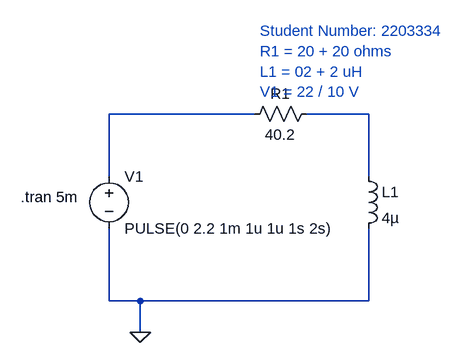
[diagram p0: schematic Lab3 - Step Response of RL Circuit.asc]
Lab3 - Step Response of RL Circuit.asc, the LTspice schematic file:
Version 4
SHEET 1 880 680
WIRE -176 -240 -400 -240
WIRE 0 -240 -96 -240
WIRE -400 -144 -400 -240
WIRE 0 -144 0 -240
WIRE -400 48 -400 -64
WIRE -352 48 -400 48
WIRE 0 48 0 -64
WIRE 0 48 -352 48
WIRE -352 96 -352 48
FLAG -352 96 0
SYMBOL res -80 -256 R90
WINDOW 0 0 56 VBottom 2
WINDOW 3 32 56 VTop 2
SYMATTR InstName R1
SYMATTR Value 40.2
SYMBOL voltage -400 -160 R0
SYMATTR InstName V1
SYMATTR Value PULSE(0 2.2 1m 1u 1u 1s 2s)
SYMBOL ind -16 -160 R0
SYMATTR InstName L1
SYMATTR Value 4µ
TEXT -168 -368 Left 2 ;Student Number: 2203334\nR1 = 20 + 20 ohms\nL1 = 02 + 2 uH\nV1 = 22 / 10 V
TEXT -536 -112 Left 2 !.tran 5m

The netlist it stands for:
* Lab3 - Step Response of RL Circuit.asc
R1 N002 N001 40.2
V1 N001 0 PULSE(0 2.2 1m 1u 1u 1s 2s)
L1 N002 0 4µ
* Student Number: 2203334
* R1 = 20 + 20 ohms
* L1 = 02 + 2 uH
* V1 = 22 / 10 V
.tran 5m
.backanno
.end